# EAGLE board 64CharTestDisp (EAGLE 9.4.2), part 1 of 3
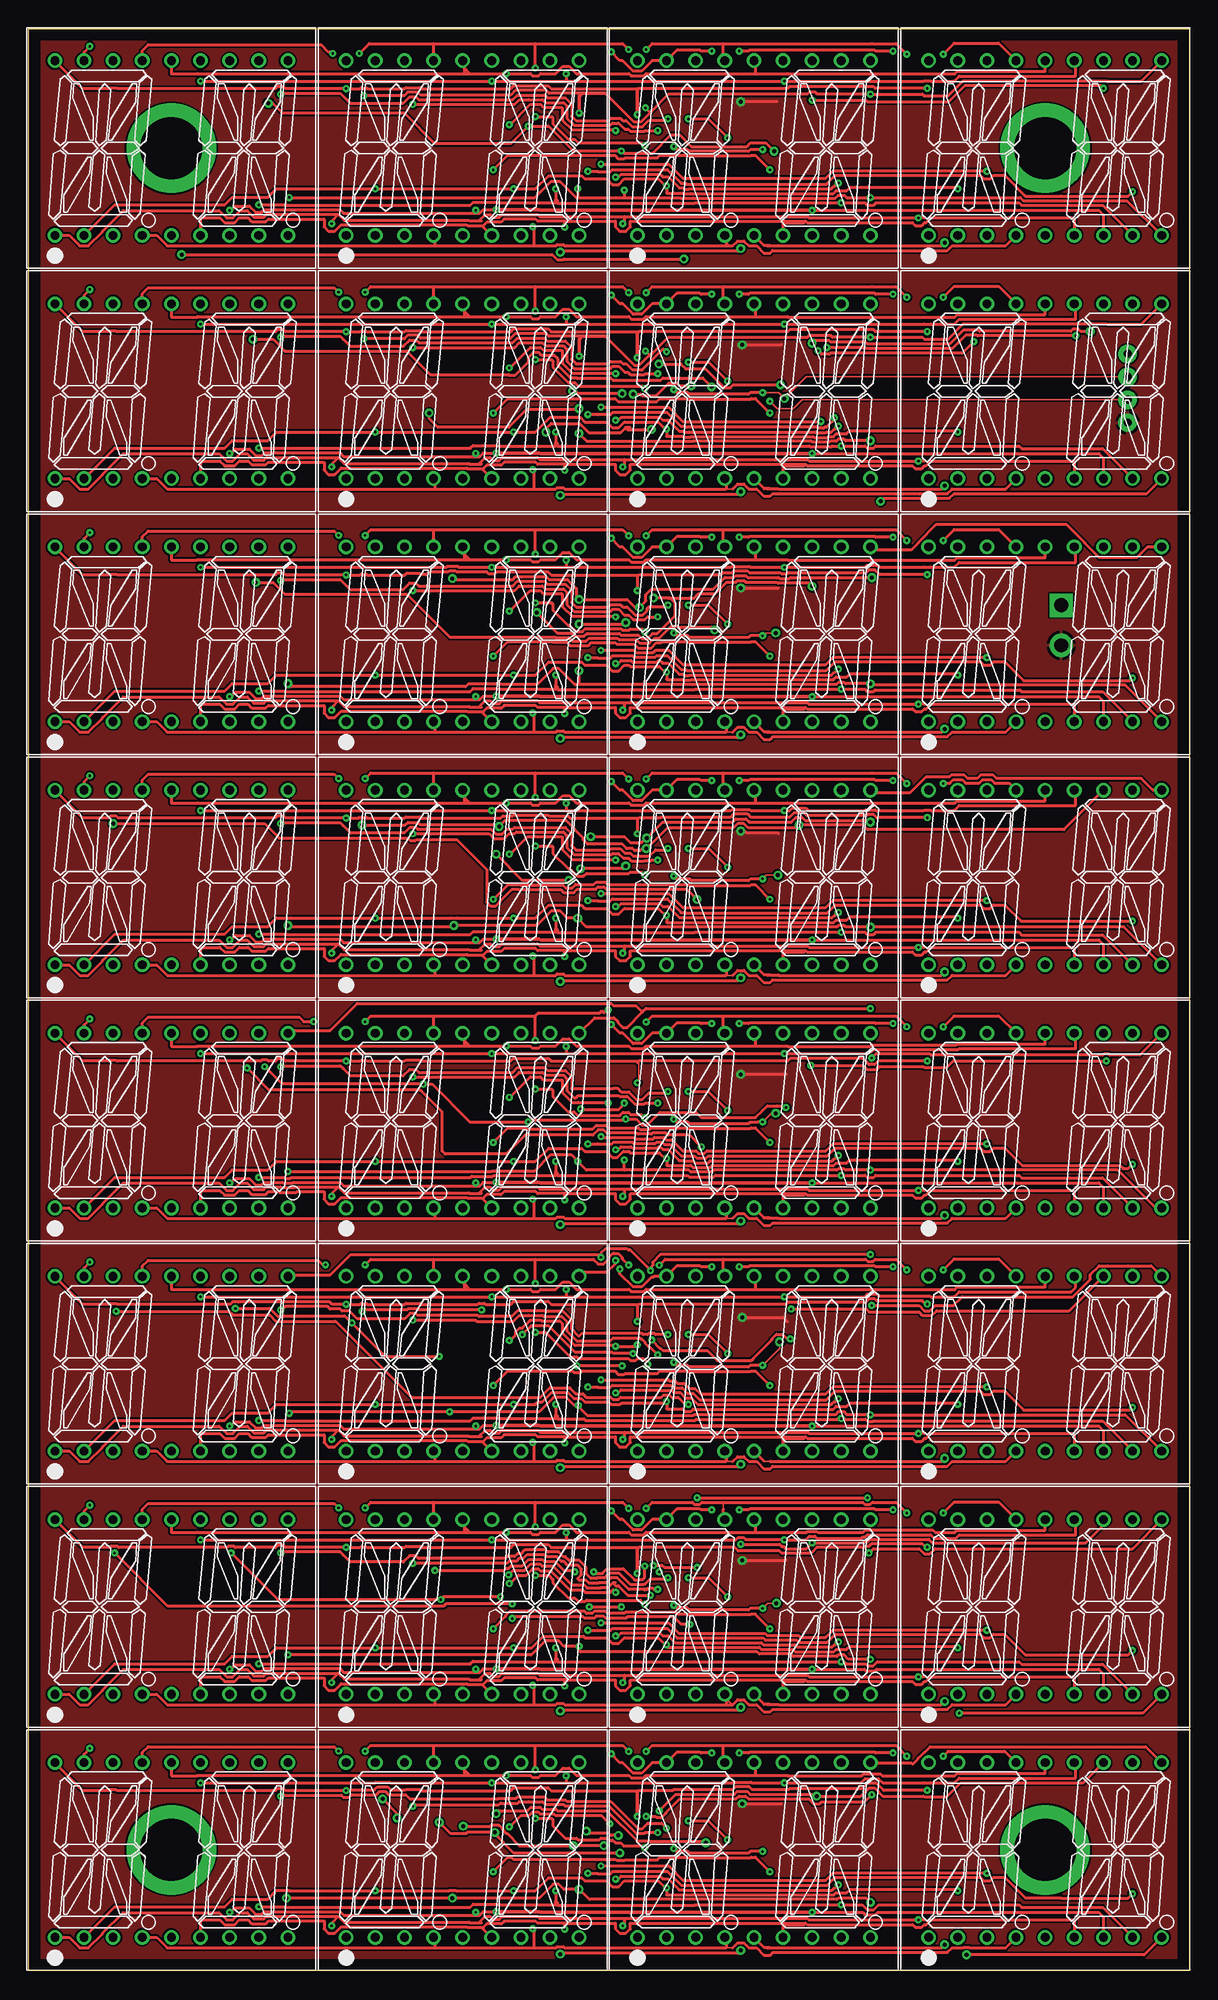
[diagram p9: board, top side]
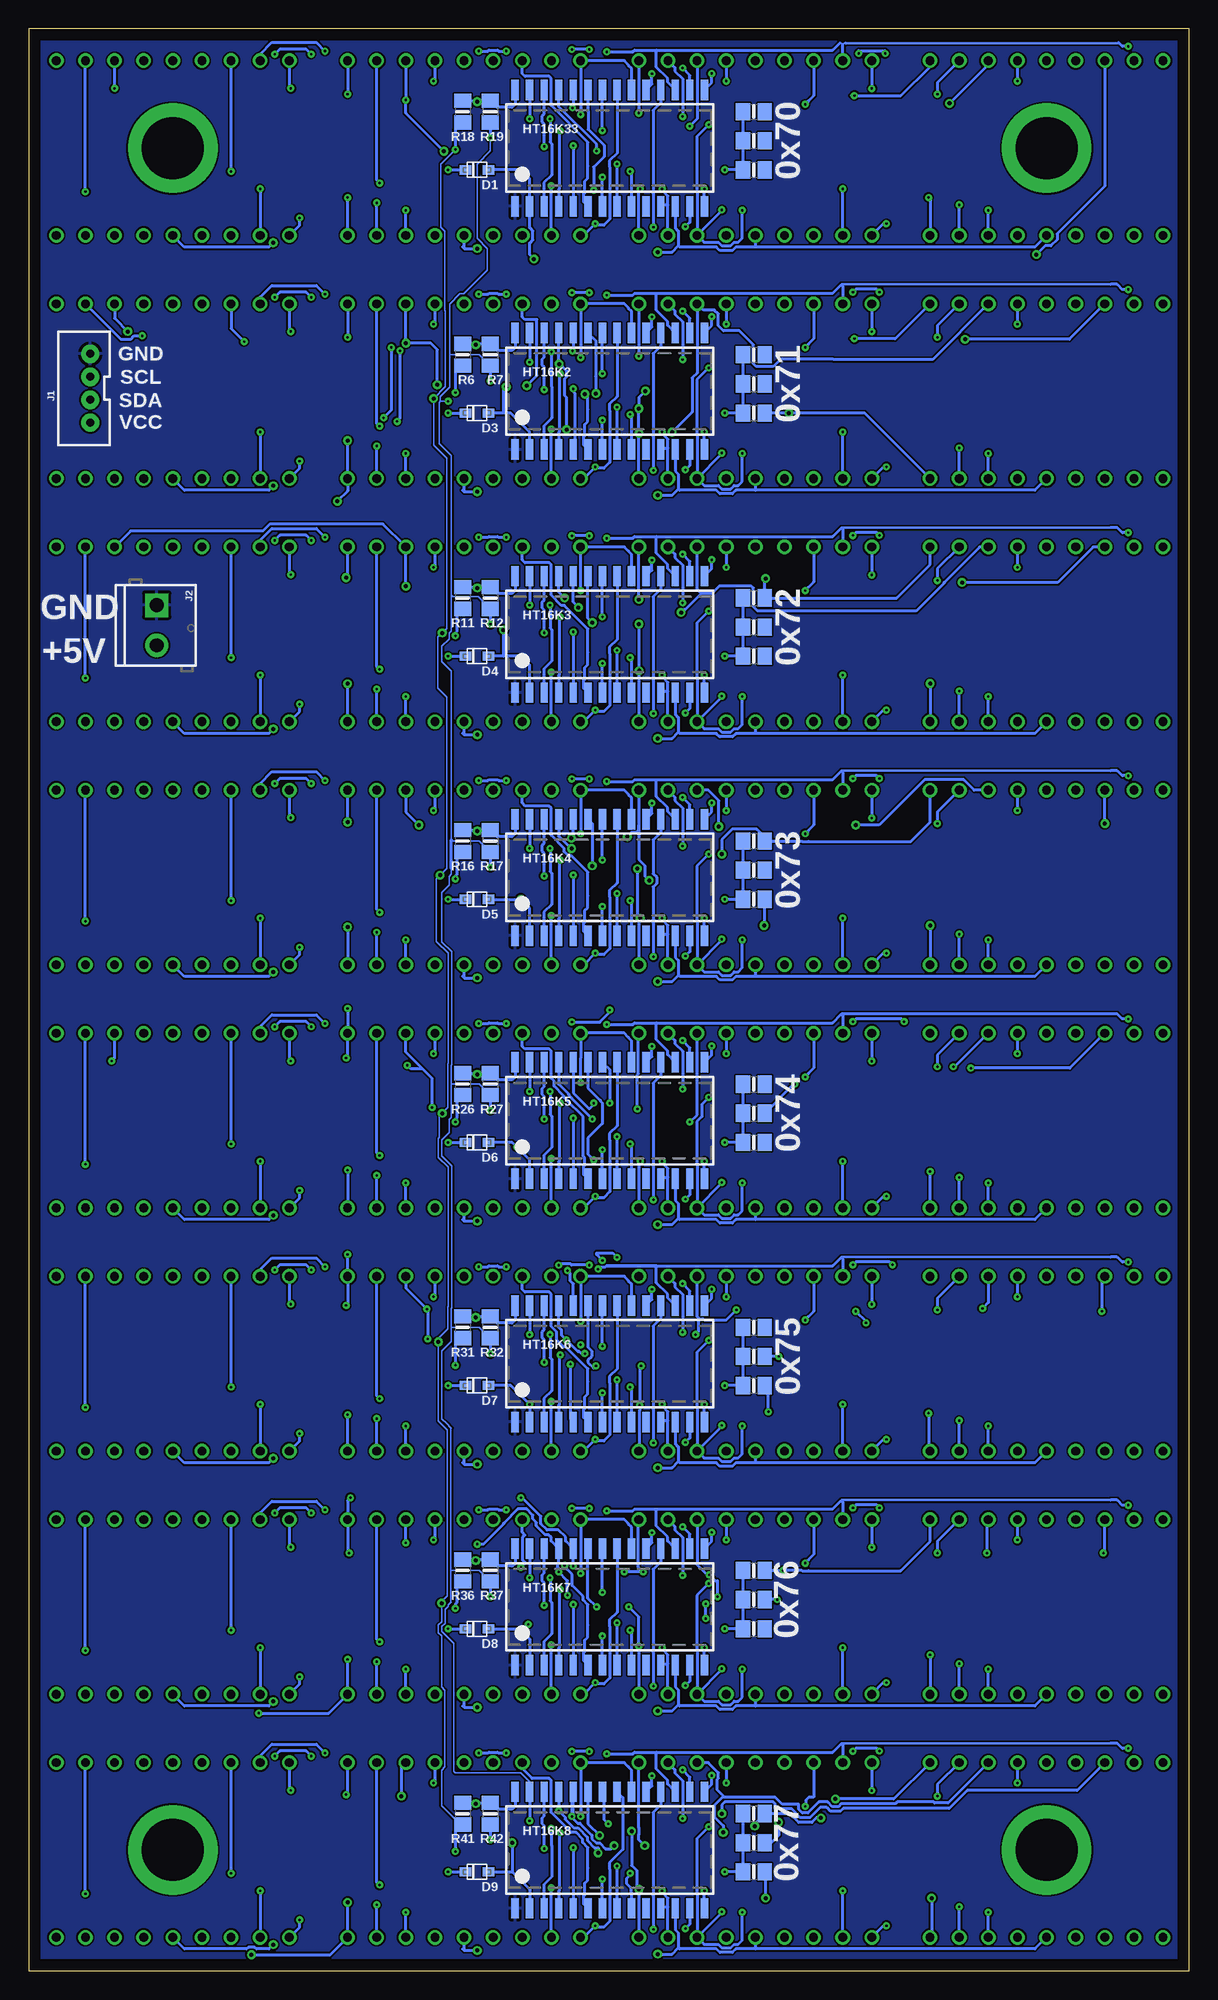
[diagram p10: board, bottom side, seen from below]

Size 101.22 x 169.42 mm. Coordinates in mm from the lower left corner, seen from the top.
Outline: 101.22,0 0,0 0,169.42 101.22,169.42 101.22,0
Copper layers (1*16): Top 0.035mm / dielectric 1.5mm / Bottom 0.035mm
Design rules "default *": minimum track width 6mil, minimum drill 0.2mm, track to track 6mil, track to pad 6mil, pad to pad 6mil, via to via 6mil, smd to smd 6mil, copper to edge 40mil, drill to drill 6mil, minimum pad ring 10mil, minimum via ring 8mil, stop-mask expansion 4mil, vias tented up to drill 0mil, thermal gap 10mil

## Footprints (pad centres in the part's own frame; a part is rotated, then mirrored left to right if it is on the bottom)
SOD-323F = smd 1 x 0.8: A -1,0; C 1,0
SOP28_300MIL_SKINNY = smd 0.635 x 1.778: P$1 -8.255,-5.08; P$2 -6.985,-5.08; P$3 -5.715,-5.08; P$4 -4.445,-5.08; P$5 -3.175,-5.08; P$6 -1.905,-5.08; P$7 -0.635,-5.08; P$8 0.635,-5.08; P$9 1.905,-5.08; P$10 3.175,-5.08; P$11 4.445,-5.08; P$12 5.715,-5.08; P$13 6.985,-5.08; P$14 8.255,-5.08; P$15 8.255,5.08; P$16 6.985,5.08; P$17 5.715,5.08; P$18 4.445,5.08; P$19 3.175,5.08; P$20 1.905,5.08; P$21 0.635,5.08; P$22 -0.635,5.08; P$23 -1.905,5.08; P$24 -3.175,5.08; P$25 -4.445,5.08; P$26 -5.715,5.08; P$27 -6.985,5.08; P$28 -8.255,5.08
JST-4-PTH-VERT = drill 0.7 pad 1.6: 1 -3,-0.55; 2 -1,-0.55; 3 1,-0.55; 4 3,-0.55
SCREWTERMINAL-3.5MM-2 = drill 1.2 pad 2.032 square: 1 0,0 | drill 1.2 pad 2.032: 2 3.5,0
0805-NO = smd 1.24 x 1.5: 1 -0.95,0; 2 0.95,0
HDSP = drill 0.762: 1 -10.16,-7.62; 2 -7.62,-7.62; 3 -5.08,-7.62; 4 -2.54,-7.62; 5 0,-7.62; 6 2.54,-7.62; 7 5.08,-7.62; 8 7.62,-7.62; 9 10.16,-7.62; 10 10.16,7.62; 11 7.62,7.62; 12 5.08,7.62; 13 2.54,7.62; 14 0,7.62; 15 -2.54,7.62; 16 -5.08,7.62; 17 -7.62,7.62; 18 -10.16,7.62
KEYSTONESTANDOFF = drill 5.41 pad 7.8: P$1 0,0

## Placement (x,y rotation side)
D1  1N4148  [SOD-323F]  62.1,157.1 180 bottom
D3  1N4148  [SOD-323F]  62.1,135.89 180 bottom
D4  1N4148  [SOD-323F]  62.1,114.68 180 bottom
D5  1N4148  [SOD-323F]  62.1,93.47 180 bottom
D6  1N4148  [SOD-323F]  62.1,72.26 180 bottom
D7  1N4148  [SOD-323F]  62.1,51.05 180 bottom
D8  1N4148  [SOD-323F]  62.1,29.84 180 bottom
D9  1N4148  [SOD-323F]  62.1,8.64 180 bottom
HT16K2  [SOP28_300MIL_SKINNY]  50.55,137.79 0 bottom
HT16K3  [SOP28_300MIL_SKINNY]  50.55,116.59 0 bottom
HT16K4  [SOP28_300MIL_SKINNY]  50.55,95.38 0 bottom
HT16K5  [SOP28_300MIL_SKINNY]  50.55,74.17 0 bottom
HT16K6  [SOP28_300MIL_SKINNY]  50.55,52.96 0 bottom
HT16K7  [SOP28_300MIL_SKINNY]  50.55,31.75 0 bottom
HT16K8  [SOP28_300MIL_SKINNY]  50.55,10.54 0 bottom
HT16K33  [SOP28_300MIL_SKINNY]  50.55,159 0 bottom
J1  [JST-4-PTH-VERT]  96.39,138.05 90 bottom
J2  [SCREWTERMINAL-3.5MM-2]  90.04,119.13 270 bottom
R6  10K  [0805-NO]  63.37,140.97 270 bottom
R7  10K  [0805-NO]  60.96,140.97 270 bottom
R8  47K  [0805-NO]  37.97,140.97 0 bottom
R9  47K  [0805-NO]  37.97,135.89 0 bottom
R10  47K  [0805-NO]  37.97,138.43 0 bottom
R11  10K  [0805-NO]  63.37,119.76 270 bottom
R12  10K  [0805-NO]  60.96,119.76 270 bottom
R13  47K  [0805-NO]  37.97,119.76 0 bottom
R14  47K  [0805-NO]  37.97,114.68 0 bottom
R15  47K  [0805-NO]  37.97,117.22 0 bottom
R16  10K  [0805-NO]  63.37,98.55 270 bottom
R17  10K  [0805-NO]  60.96,98.55 270 bottom
R18  10K  [0805-NO]  63.37,162.18 270 bottom
R19  10K  [0805-NO]  60.96,162.18 270 bottom
R20  47K  [0805-NO]  37.97,162.18 0 bottom
R21  47K  [0805-NO]  37.97,157.1 0 bottom
R22  47K  [0805-NO]  37.97,159.64 0 bottom
R23  47K  [0805-NO]  37.97,98.55 0 bottom
R24  47K  [0805-NO]  37.97,93.47 0 bottom
R25  47K  [0805-NO]  37.97,96.01 0 bottom
R26  10K  [0805-NO]  63.37,77.34 270 bottom
R27  10K  [0805-NO]  60.96,77.34 270 bottom
R28  47K  [0805-NO]  37.97,77.34 0 bottom
R29  47K  [0805-NO]  37.97,72.26 0 bottom
R30  47K  [0805-NO]  37.97,74.8 0 bottom
R31  10K  [0805-NO]  63.37,56.13 270 bottom
R32  10K  [0805-NO]  60.96,56.13 270 bottom
R33  47K  [0805-NO]  37.97,56.13 0 bottom
R34  47K  [0805-NO]  37.97,51.05 0 bottom
R35  47K  [0805-NO]  37.97,53.59 0 bottom
R36  10K  [0805-NO]  63.37,34.92 270 bottom
R37  10K  [0805-NO]  60.96,34.92 270 bottom
R38  47K  [0805-NO]  37.97,34.92 0 bottom
R39  47K  [0805-NO]  37.97,29.84 0 bottom
R40  47K  [0805-NO]  37.97,32.38 0 bottom
R41  10K  [0805-NO]  63.37,13.72 270 bottom
R42  10K  [0805-NO]  60.96,13.72 270 bottom
R43  47K  [0805-NO]  37.97,13.72 0 bottom
R44  47K  [0805-NO]  37.97,8.64 0 bottom
R45  47K  [0805-NO]  37.97,11.18 0 bottom
U$2  BIG14SEG  [HDSP]  12.45,159 0 top
U$3  BIG14SEG  [HDSP]  37.85,159 0 top
U$4  BIG14SEG  [HDSP]  63.25,159 0 top
U$5  BIG14SEG  [HDSP]  88.65,159 0 top
U$11  BIG14SEG  [HDSP]  12.45,137.79 0 top
U$12  BIG14SEG  [HDSP]  37.85,137.79 0 top
U$13  BIG14SEG  [HDSP]  63.25,137.79 0 top
U$14  BIG14SEG  [HDSP]  88.65,137.79 0 top
U$15  BIG14SEG  [HDSP]  12.45,116.59 0 top
U$16  BIG14SEG  [HDSP]  37.85,116.59 0 top
U$17  BIG14SEG  [HDSP]  63.25,116.59 0 top
U$18  BIG14SEG  [HDSP]  88.65,116.59 0 top
U$19  BIG14SEG  [HDSP]  12.45,95.38 0 top
U$20  BIG14SEG  [HDSP]  37.85,95.38 0 top
U$21  BIG14SEG  [HDSP]  63.25,95.38 0 top
U$22  BIG14SEG  [HDSP]  88.65,95.38 0 top
U$23  BIG14SEG  [HDSP]  12.45,74.17 0 top
U$24  BIG14SEG  [HDSP]  37.85,74.17 0 top
U$25  BIG14SEG  [HDSP]  63.25,74.17 0 top
U$26  BIG14SEG  [HDSP]  88.65,74.17 0 top
U$27  BIG14SEG  [HDSP]  12.45,52.96 0 top
U$28  BIG14SEG  [HDSP]  37.85,52.96 0 top
U$29  BIG14SEG  [HDSP]  63.25,52.96 0 top
U$30  BIG14SEG  [HDSP]  88.65,52.96 0 top
U$31  BIG14SEG  [HDSP]  12.45,31.75 0 top
U$32  BIG14SEG  [HDSP]  37.85,31.75 0 top
U$33  BIG14SEG  [HDSP]  63.25,31.75 0 top
U$34  BIG14SEG  [HDSP]  88.65,31.75 0 top
U$35  KEYSTONESTANDOFF  [KEYSTONESTANDOFF]  12.45,159 0 top
U$36  KEYSTONESTANDOFF  [KEYSTONESTANDOFF]  88.65,159 0 top
U$37  BIG14SEG  [HDSP]  12.45,10.54 0 top
U$38  BIG14SEG  [HDSP]  37.85,10.54 0 top
U$39  BIG14SEG  [HDSP]  63.25,10.54 0 top
U$40  BIG14SEG  [HDSP]  88.65,10.54 0 top
U$41  KEYSTONESTANDOFF  [KEYSTONESTANDOFF]  12.45,10.54 0 top
U$42  KEYSTONESTANDOFF  [KEYSTONESTANDOFF]  88.65,10.54 0 top

## Tracks (layer width: path | path; a pad name or v marks a point on that pad's centre or on a via)
1A0  (via drill 0.2)
  Top 0.254: v22.73,154.69 44.15,154.69 45.57,156.11 46.33,156.11 47.75,154.69 48.01,154.69 | v47.88,155.45 47.88,154.81 48.01,154.69 | 48.01,154.69 51.24,154.69 51.27,154.66 51.94,154.66 | 51.94,154.66 56.85,154.66 56.9,154.61 57.91,154.61 57.93,154.63 70.34,154.63 70.59,154.88 71.14,154.88 71.33,154.69 v73.41,154.69 86.48,154.69 86.76,154.41 95.78,154.41 U$5.9 | 51.82,155.32 v51.94,155.32 51.94,154.66
  Bottom 0.254: U$2.9 22.61,154.56 v22.73,154.69 | U$4.9 v73.41,154.69 | U$3.9 48.01,155.32 v47.88,155.45 | HT16K33.P$23 52.45,162.22 52.43,162.2 52.43,160.63 51.03,159.24 51.03,158.26 51.94,157.35 v51.94,155.32
1A1  (via drill 0.2)
  Top 0.254: U$5.10 97.03,164.85 94.02,164.85 94,164.87 81.49,164.87 80.18,163.55 78.09,163.55 77.94,163.7 v73.41,163.7 68.75,163.7 68.6,163.85 68.05,163.85 67.9,163.7 55.79,163.7 54.19,162.09 | 48.01,163.58 v48.01,162.05 48.01,163.5 48.04,163.54 | v29.21,163.58 32.76,163.58 33.06,163.88 33.94,163.88 34.19,163.63 42.04,163.63 42.45,164.03 45.14,164.03 45.39,163.78 50.3,163.78 | 54.19,162.09 53.36,161.27 52.81,161.27 50.3,163.78 | 48.13,163.63 48.04,163.54 | v53.79,162.5 53.79,162.49 54.19,162.09 | 48.04,163.54 48.29,163.78 50.3,163.78
  Bottom 0.254: U$2.10 22.61,166.12 25.15,163.58 v29.21,163.58 29.46,163.58 | U$4.10 v73.41,163.7 | U$3.10 v48.01,162.05 | HT16K33.P$24 53.72,162.57 v53.79,162.5
1A2  (via drill 0.2, 0.35)
  Top 0.254: v68.33,163.19 72.98,163.19 73.13,163.04 80.24,163.04 81.66,164.47 93.47,164.47 v93.73,164.21 | 62.1,159.13 57.78,159.13 56.77,160.15 56.01,160.15 54.41,158.56 51.88,158.56 v51.69,158.75 51.33,158.75 51.31,158.78 47.47,158.78 45.34,160.91 v43.56,160.91 42.04,159.38 35.42,159.38 32.78,162.03 22.14,162.03 21.27,162.9 v20.91,162.9 | 62.1,159.13 62.61,159.13 | 62.1,159.13 62.61,159.13 | 62.61,159.13 62.94,159.46 64.28,159.46 v65.01,158.74
  Bottom 0.254: U$4.12 v68.33,163.19 68.33,162.05 v65.01,158.74 | v93.73,164.21 U$5.12 | U$3.12 42.93,161.54 v43.56,160.91 | v51.69,158.75 51.69,159.32 54.99,162.62 HT16K33.P$25 | v20.91,162.9 17.53,166.29 U$2.12
2A0  (via drill 0.35)
  Top 0.254: v48.01,136.27 47.9,136.17 43.4,136.17 41.87,134.65 35.69,134.65 34.92,135.41 v34.92,135.89 | v51.74,137.6 47.95,137.6 47.73,137.82 v47.43,137.82 | v74.3,128.2 74.55,128.45 80.3,128.45 80.7,128.85 97.48,128.85 U$14.9 | v73.41,133.48 71.23,133.48 71.11,133.6 70.62,133.6 70.45,133.42 69.91,133.42 69.83,133.35 68.34,133.35 68.27,133.42 57.93,133.42 57.91,133.4 48.7,133.4 v47.98,134.11
  Bottom 0.254: U$11.9 28.32,135.89 v34.92,135.89 R9.2 | U$12.9 48.01,134.11 | 48.01,134.11 48.01,134.24 48.01,136.14 | 48.01,136.14 v48.01,136.27 | HT16K2.P$23 51.78,142.2 51.78,139.09 51.74,139.06 v51.74,137.6 | v47.43,137.82 48.01,137.24 48.01,136.14 | v74.3,128.2 73.41,129.09 U$13.9 v73.41,133.48 | v47.98,134.11 48.01,134.11
2A1  (via drill 0.2)
  Top 0.254: U$14.10 97.03,143.64 94.02,143.64 94,143.66 81.49,143.66 80.18,142.34 78.09,142.34 77.94,142.49 v73.41,142.49 70.11,142.49 69.96,142.64 68.05,142.64 67.9,142.49 55.79,142.49 54.19,140.89 | 48.01,142.37 v48.01,140.84 48.01,142.29 48.04,142.33 | v29.21,142.37 32.76,142.37 33.06,142.67 33.94,142.67 34.19,142.42 42.04,142.42 42.45,142.82 45.14,142.82 45.39,142.57 50.3,142.57 | 48.13,142.42 48.04,142.33 | 50.3,142.57 52.81,140.06 53.21,140.06 53.29,140.13 53.33,140.13 54.08,140.89 54.19,140.89 | v53.79,141.29 53.79,141.28 54.19,140.89 | 48.04,142.33 48.29,142.57 50.3,142.57
  Bottom 0.254: 29.46,142.37 v29.21,142.37 25.65,142.37 U$11.10 | U$13.10 v73.41,142.49 | U$12.10 v48.01,140.84 | HT16K2.P$24 53.72,141.37 v53.79,141.29
2A2  (via drill 0.35)
  Top 0.254: v45.1,134.22 45.1,134.51 45.57,134.98 45.59,134.98 | 45.59,134.98 45.97,134.98 | 45.59,134.98 48.05,134.98 48.84,134.19 51.62,134.19 52.05,134.62 | 52.45,134.62 52.05,134.62 | 52.05,134.62 52.22,134.45 v54.31,134.45 | v54.97,140.16 56.88,140.16 57.29,139.75 59,139.75 60.65,138.1 61.19,138.1 61.44,138.35 v65.58,138.35 | v92.58,143 91.75,143 91.55,143.2 91.07,143.2 90.9,143.03 82.91,143.03 82.83,143.1 81.51,143.1 80.32,141.91 73.17,141.91 72.99,142.09 69.94,142.09 69.84,142.19 68.53,142.19 v68.33,141.99
  Bottom 0.254: U$11.12 22.38,140.56 31.03,140.56 31.05,140.59 35.64,140.59 36.29,139.94 37.76,139.94 38.02,140.21 38.02,141.84 39.24,143.05 40.63,143.05 41.07,143.5 41.07,144.54 41.41,144.88 42.39,144.88 U$12.12 42.93,139.39 43.35,138.96 43.35,135.97 v45.1,134.22 | U$14.12 93.73,144.15 v92.58,143 | U$13.12 v68.33,141.99 66.17,141.99 65.58,141.4 v65.58,138.35 | v54.31,134.45 54.31,137.24 54.48,137.41 54.48,138.88 54.28,139.08 54.28,139.56 54.9,140.18 54.99,140.27 54.99,140.59 | 54.99,140.59 HT16K2.P$25 | 54.99,140.59 54.99,140.19 v54.97,140.16
3A0  (via drill 0.35)
  Top 0.254: 47.88,112.19 57.91,112.19 57.93,112.21 70.45,112.21 70.62,112.39 71.11,112.39 71.23,112.27 v73.41,112.27 73.53,112.14 95.63,112.14 U$18.9 | 47.88,112.19 47.64,112.19 46.21,113.61 45.73,113.61 44.33,112.21 41.26,112.21 41.21,112.26 38.35,112.26 38.1,112.02 22.88,112.02 v22.61,112.29 | v47.98,113.41 47.98,112.3 47.88,112.19 | v48.01,117.47 51.94,117.47 v52.07,117.6
  Bottom 0.254: U$17.9 v73.41,112.27 | v22.61,112.29 U$15.9 | U$16.9 47.98,108.99 v47.98,113.41 47.98,117.45 v48.01,117.47 | v52.07,117.6 52.45,117.98 HT16K3.P$23
3A1  (via drill 0.35)
  Top 0.254: U$18.10 97.56,124.21 96.65,123.29 93.35,123.29 92.1,124.54 92.1,124.58 90.55,126.14 79.12,126.14 77.57,124.58 77.57,124.56 76.96,123.95 73.66,123.95 U$17.10 | v36.96,121.46 37.08,121.33 42.16,121.33 42.45,121.61 45.14,121.61 45.39,121.36 46.98,121.36 47.75,120.59 47.75,119.89 v48.01,119.63 52.2,119.63 53.09,118.75 v53.28,118.94 53.82,119.48 53.82,120.03 54.31,120.52 59.69,120.52 60.71,121.54 61.51,121.54 61.66,121.69 62.54,121.69 62.7,121.54 65.4,121.54 65.5,121.44 66.32,121.44 66.42,121.54 67.18,121.54 | 67.18,121.54 67.67,121.54 | 67.18,121.54 v73.53,121.54
  Bottom 0.254: U$15.10 22.61,122.68 25.53,119.76 R13.2 37.02,121.39 v36.96,121.46 | v48.01,119.63 U$16.10 | v53.28,118.94 53.72,119.38 HT16K3.P$24 | v73.53,121.54 73.41,121.67 U$17.10
3A2  (via drill 0.35)
  Top 0.254: v44.32,118.5 46.11,116.71 47.26,116.71 47.56,116.41 48.45,116.41 48.7,116.66 51.5,116.66 51.63,116.54 53.15,116.54 53.48,116.21 53.96,116.21 54.41,116.66 54.81,116.66 56.34,118.19 56.34,119.37 55.94,119.76 55.75,119.76 | 55.75,119.76 v54.48,119.76 | 55.75,119.76 58.04,119.76 58.39,120.12 59.86,120.12 60.87,121.13 61.68,121.13 61.83,121.28 62.38,121.28 62.53,121.13 65.23,121.13 65.34,121.03 68.07,121.03 v68.33,120.78
  Bottom 0.254: U$17.12 68.39,124.27 | 68.39,124.27 70.33,126.21 80.18,126.21 80.79,125.6 92.33,125.6 U$18.12 | U$15.12 18.29,124.21 21.39,121.11 21.39,121.04 23.81,118.62 37.64,118.62 38.02,119 38.02,120.63 38.19,120.79 41.01,120.79 41.66,120.14 42.54,120.14 | 42.54,120.14 42.93,120.52 U$16.12 | v44.32,118.5 44.07,118.75 43.95,118.75 42.56,120.14 42.54,120.14 | v54.48,119.76 54.99,120.27 HT16K3.P$25 | v68.33,120.78 U$17.12 | U$17.12 68.39,124.27
4A0  (via drill 0.35)
  Top 0.254: U$22.9 95.5,91.06 v73.41,91.06 71.23,91.06 71.11,91.18 70.62,91.18 70.51,91.06 48.64,91.06 v47.88,91.82 46.99,91.82 46.35,92.46 45.59,92.46 44.32,91.19 v37.08,91.19 36.96,91.06 22.73,91.06 v22.61,91.19 | v52.07,96.39 51.82,96.14 v48.13,96.14
  Bottom 0.254: v73.41,91.06 U$21.9 | U$20.9 48.01,91.69 v47.88,91.82 48.13,92.08 v48.13,96.14 | v37.08,91.19 37.02,91.25 R24.2 | v22.61,91.19 U$19.9 | HT16K4.P$23 52.07,100.08 v52.07,96.39
4A1  (via drill 0.35)
  Top 0.254: v47.12,95.12 43.05,95.12 v40.77,97.41 | v49.02,98.93 51.94,98.93 52.45,98.42 53.46,98.42 53.46,98.43 | 53.46,98.43 53.59,98.55 | 53.46,98.43 53.84,98.81 v53.89,98.81 55.28,100.2 61.38,100.2 61.66,100.48 62.54,100.48 62.82,100.2 66.51,100.2 66.91,100.61 67.45,100.61 67.71,100.36 72.92,100.36 73.07,100.2 v73.41,100.2 | U$22.10 98.04,103 97.03,104.01 84.42,104.01 84.11,104.32 83.02,104.32 82.71,104.01 81.88,104.01 81.57,104.32 80.48,104.32 80.3,104.14 78.23,104.14 76.84,102.74 73.66,102.74 U$21.10
  Bottom 0.254: 33.23,98.53 33.2,98.55 | 33.23,98.53 33.77,98.53 33.79,98.55 R23.2 37.02,98.87 37.73,99.58 39.86,99.58 40.77,98.68 v40.77,97.41 | 33.23,98.53 24.28,98.53 22.61,100.2 U$19.10 | U$20.10 48.01,99.95 | 48.01,99.95 48.01,96.94 47.47,96.41 47.47,95.48 v47.12,95.12 | 48.01,99.95 48.04,99.91 48.04,99.45 48.21,99.29 48.67,99.29 v49.02,98.93 | v53.89,98.81 53.72,98.97 HT16K4.P$24 | v73.41,100.2 U$21.10
4A2  (via drill 0.35)
  Top 0.254: v29.08,99.95 32.86,99.95 33.09,100.18 33.91,100.18 34.09,100 40.84,100 v41.02,99.82 41.53,100.33 46.86,100.33 48.36,98.83 48.36,98.66 48.75,98.28 49.29,98.28 49.31,98.3 51.76,98.3 52.16,97.9 52.66,97.9 52.84,97.72 53.33,97.72 53.51,97.9 v53.87,97.9 54.12,98.15 54.16,98.15 55.7,99.69 61.45,99.69 61.83,100.08 62.38,100.08 62.76,99.69 66.93,99.69 v67.18,99.95 72.73,99.95 73.13,99.55 90.27,99.55 U$22.12
  Bottom 0.254: U$19.12 18.77,103 19.69,103.91 23.09,103.91 27.05,99.95 v29.08,99.95 | v41.02,99.82 41.02,102.07 41.95,103 U$20.12 | v53.87,97.9 54.12,98.15 54.16,98.15 54.99,98.98 HT16K4.P$25 | U$21.12 68.33,101.09 v67.18,99.95
5A0  (via drill 0.2)
  Top 0.254: U$26.9 98.3,66.55 95,69.85 v73.41,69.85 71.23,69.85 71.11,69.97 70.62,69.97 70.51,69.85 59.77,69.85 59.59,69.67 57.76,69.67 57.58,69.85 51.94,69.85 | v22.61,69.72 40.31,69.72 40.36,69.77 44.11,69.77 45.54,71.19 47.3,71.19 v47.88,70.61 48.64,69.85 51.94,69.85 | 51.94,69.85 v51.94,70.74
  Bottom 0.254: v73.41,69.85 U$25.9 | v47.88,70.61 48.01,70.48 U$24.9 | U$23.9 v22.61,69.72 | v51.94,70.74 52.45,71.25 52.45,72.64 51.18,73.91 51.18,75.69 51.36,75.87 51.36,75.93 52.45,77.03 HT16K5.P$23
5A1  (via drill 0.2)
  Top 0.254: v51.94,75.69 51.76,75.52 51.76,75.45 51.42,75.11 48.21,75.11 v48.13,75.18 | U$23.10 22.86,82.04 26.29,82.04 28.65,84.4 50.79,84.4 50.99,84.2 52.96,84.2 53.53,83.63 | U$24.10 49.35,83.13 51.04,83.13 51.38,82.79 51.38,82.73 51.82,82.3 52.2,82.3 53.53,83.63 | 53.53,83.63 53.85,83.95 v73.41,83.95 | U$26.10 96.9,79.88 94.3,79.88 94.22,79.96 93.74,79.96 93.66,79.88 78.68,79.88 78.6,79.96 73.86,79.96 v73.53,79.63
  Bottom 0.254: HT16K5.P$24 53.72,76.58 52.32,75.18 51.94,75.57 v51.94,75.69 | v48.13,75.18 48.13,78.15 48.04,78.24 48.04,81.75 U$24.10 | v73.41,83.95 U$25.10 73.41,79.76 v73.53,79.63
5A2  (via drill 0.2)
  Top 0.254: v20.57,78.87 22.1,77.34 v34.42,77.34 35.18,77.34 38.48,74.04 v43.56,74.04 43.69,74.17 51.94,74.17 v52.07,74.3 52.98,74.3 53.48,73.79 53.96,73.79 55.05,74.88 56.26,74.88 58.22,74.88 58.67,74.42 63.37,74.42 64.01,75.06 64.41,75.46 65.28,75.46 65.89,75.46 v66.04,75.31 | v68.2,78.99 72.77,78.99 73.12,78.64 73.94,78.64 74.17,78.87 78.04,78.87 78.12,78.79 80.06,78.79 80.65,79.38 v93.98,79.38
  Bottom 0.254: R30.2 34.48,77.34 v34.42,77.34 | v20.57,78.87 20.45,78.87 U$23.12 | v52.07,74.3 53.88,76.1 53.88,76.16 54.13,76.41 54.13,76.48 54.99,77.34 HT16K5.P$25 | v43.56,74.04 42.93,74.68 U$24.12 | v66.04,75.31 66.04,77.85 66.87,78.68 | U$25.12 68.33,80.14 66.87,78.68 | 66.87,78.68 67.88,78.68 v68.2,78.99 | v93.98,79.38 93.73,79.63 U$26.12
6A0  (via drill 0.2)
  Top 0.254: U$30.9 95.63,48.51 v73.41,48.51 71.35,48.51 71.11,48.76 70.62,48.76 70.38,48.51 58.04,48.51 57.94,48.41 48.74,48.41 47.88,49.28 v47.94,49.34 47.56,49.34 46.86,50.04 45.78,50.04 44.52,48.77 v36.7,48.77 22.86,48.77 v22.73,48.64 | v51.75,52.77 47.94,52.77 47.88,52.83 v47.82,52.77
  Bottom 0.254: U$29.9 v73.41,48.51 | v47.94,49.34 47.94,49.28 | 47.94,49.28 47.94,48.91 47.97,48.88 47.97,45.38 U$28.9 | v22.73,48.64 22.73,45.47 U$27.9 | v36.7,48.77 36.7,50.73 R34.2 | v51.75,52.77 51.94,52.58 52.45,53.09 52.45,53.28 52.12,53.61 52.12,54.09 52.45,54.42 HT16K6.P$23 | v47.82,52.77 47.94,52.64 47.94,49.28
6A1  (via drill 0.2)
  Top 0.254: U$27.10 22.73,60.71 26.29,60.71 28.07,62.48 49.66,62.48 v49.91,62.23 49.91,62.61 50.29,62.99 52.2,62.99 52.32,62.87 52.45,62.87 54.1,61.21 | U$28.10 48.39,60.96 50.42,60.96 51.18,61.72 v51.18,61.98 | v54.23,61.09 54.1,61.21 | 54.1,61.21 54.41,61.52 54.41,61.8 55.1,62.48 v73.41,62.48 | v73.53,58.04 77.66,58.04 78.12,57.58 78.6,57.58 79.06,58.04 80.65,58.04 81.41,58.8 91.06,58.8 92.58,60.33 92.58,60.73 93.35,61.49 94.11,61.49 94.13,61.47 95.86,61.47 95.89,61.49 97.89,61.49 U$30.10
  Bottom 0.254: v51.18,61.98 51.69,62.48 51.69,62.61 50.29,62.61 v49.91,62.23 | HT16K6.P$24 53.72,59.92 54,60.2 54,60.86 v54.23,61.09 | v73.41,62.48 U$29.10 73.41,58.17 v73.53,58.04
6A2  (via drill 0.2)
  Top 0.254: v18.03,57.78 21.02,57.78 21.73,57.08 22.21,57.08 22.29,57.15 27.56,57.15 v28.19,56.52 31.12,53.59 v35.81,53.59 | v39.5,57.66 34.01,57.66 33.91,57.76 33.09,57.76 32.99,57.66 29.21,57.66 v29.08,57.53 | v43.05,55.5 43.81,56.26 43.93,56.26 43.95,56.29 45.31,56.29 47.62,53.98 49.4,53.98 | 49.4,53.98 49.66,53.98 | 49.4,53.98 50.86,53.98 50.94,53.9 52.65,53.9 v52.7,53.85 | v54.32,55.02 55.04,54.3 55.1,54.3 55.31,54.1 55.88,54.1 59.18,54.1 59.94,53.34 60.02,53.27 63.04,53.27 63.25,53.47 64.82,55.04 64.82,55.14 65.21,55.52 65.75,55.52 66.16,55.12 v66.42,55.12 | U$30.12 90.73,57.58 79.18,57.58 78.77,57.18 77.95,57.18 77.67,57.46 73.29,57.46 73.03,57.72 v66.48,57.72
  Bottom 0.254: U$27.12 17.53,58.29 v18.03,57.78 | v35.81,53.59 R35.2 | U$28.12 42.93,57.07 42.84,56.98 | 42.84,56.98 42.72,56.87 42.39,56.87 42.29,56.77 40.39,56.77 v39.5,57.66 | v29.08,57.53 28.19,56.64 v28.19,56.52 | 42.84,56.98 42.84,55.71 v43.05,55.5 | v52.7,53.85 53,53.85 53.18,54.03 53.33,54.03 v54.32,55.02 54.76,55.46 54.76,55.91 54.99,56.14 HT16K6.P$25 | v66.42,55.12 66.42,57.66 v66.48,57.72 68.33,59.56 U$29.12
7A0  (via drill 0.2)
  Top 0.254: v73.41,27.18 71.48,27.18 71.11,27.55 70.62,27.55 70.5,27.42 66.69,27.42 66.47,27.64 63.73,27.64 63.55,27.81 48.13,27.81 48.01,27.94 v48.01,28.32 46.67,28.32 46.21,28.78 45.03,28.78 43.81,27.56 v22.61,27.56 | v48.89,31.75 v51.69,31.75 | U$34.9 97.16,22.48 v81.15,22.48
  Bottom 0.254: v73.41,27.18 U$33.9 75.06,22.48 v81.15,22.48 | U$32.9 v48.01,28.32 48.01,30.86 v48.89,31.75 | v22.61,27.56 U$31.9 | v51.69,31.75 52.45,32.51 HT16K7.P$23
7A1  (via drill 0.2)
  Top 0.254: v47.62,34.8 47.5,34.92 46.68,34.92 45.89,35.71 44.95,35.71 44.77,35.89 43.62,35.89 43.06,35.33 42.07,35.33 41.86,35.12 41.62,35.12 41.42,34.92 v35.43,34.92 | v49.28,34.8 49.4,34.67 50.03,34.67 50.43,35.08 51.86,35.08 52.84,34.09 53.33,34.09 53.37,34.13 53.56,34.13 53.72,34.29 53.72,35.18 v53.72,35.31 | v58.29,41.27 v73.15,41.27 | v73.28,36.45 73.66,36.83 77.66,36.83 78.12,36.37 78.6,36.37 79.06,36.83 96.27,36.83 U$34.10
  Bottom 0.254: 33.2,34.92 33.23,34.9 | 33.23,34.9 33.77,34.9 33.79,34.92 v35.43,34.92 R38.2 | 33.23,34.9 25.17,34.9 22.61,37.46 U$31.10 | U$32.10 48.04,39.33 48.04,35.22 v47.62,34.8 v49.28,34.8 | v53.72,35.31 HT16K7.P$24 54.39,37.5 54.39,37.84 55.02,38.46 56,38.46 56.54,38.99 56.54,39.65 58.17,41.27 v58.29,41.27 | v73.15,41.27 73.41,41.02 U$33.10 73.41,36.58 v73.28,36.45
7A2  (via drill 0.2)
  Top 0.254: v17.65,36.45 21.72,32.38 v35.94,32.38 36.2,32.64 v41.15,32.64 | v41.86,34.54 42.24,34.92 43.23,34.92 43.79,35.48 44.61,35.48 44.78,35.31 45.72,35.31 47.37,33.66 48.45,33.66 48.7,33.4 49.85,33.4 49.9,33.45 50.55,33.45 50.6,33.5 50.6,33.52 50.94,33.86 | 51.18,33.86 50.94,33.86 | 50.94,33.86 51.19,33.6 51.42,33.6 52.26,32.77 v54.23,32.77 | v62.1,37.21 65.47,37.21 65.67,37.01 65.86,37.01 66.04,36.83 67.82,36.83 v68.33,37.34 72.77,37.34 72.87,37.44 73.12,37.44 73.32,37.64 78.5,37.64 78.8,37.34 92.2,37.34 93.73,38.86 U$34.12
  Bottom 0.254: U$31.12 17.65,39.24 v17.65,36.45 | v35.94,32.38 R40.2 | U$32.12 42.93,35.43 41.86,34.37 41.78,34.37 | 41.78,34.37 41.67,34.37 41.34,34.04 41.15,34.04 v41.15,32.64 | 41.78,34.37 41.86,34.44 v41.86,34.54 | v54.23,32.77 54.23,34.04 v54.99,34.8 54.99,35.05 55.06,35.12 55.06,35.6 54.99,35.67 HT16K7.P$25 55.66,37.5 55.66,37.84 55.88,38.05 56.17,38.05 56.95,38.82 56.95,39.12 57.25,39.42 57.25,39.75 57.79,40.28 58.54,40.28 59.79,39.04 59.79,38.99 61.57,37.21 v62.1,37.21 | v68.33,37.34 U$33.12
8A0  (via drill 0.35)
  Top 0.254: U$40.9 97.28,1.4 v81.79,1.4 | v73.41,5.97 73.03,6.34 70.62,6.34 70.51,6.22 48.89,6.22 v48.01,7.11 46.67,7.11 46.21,7.57 45.73,7.57 44.52,6.35 v36.96,6.35 v22.48,6.35 | v51.43,11.81 50.78,11.81 50.61,11.99 48.85,11.99 v48.64,12.19
  Bottom 0.254: v81.79,1.4 74.93,1.4 U$39.9 v73.41,5.97 | U$38.9 v48.01,7.11 48.18,7.29 48.18,8.51 48.18,8.75 48.64,9.21 v48.64,12.19 | HT16K8.P$23 52.45,12.83 v51.43,11.81 | v36.96,6.35 36.96,8.57 R44.2 | v22.48,6.35 22.48,3.05 U$37.9
8A1  (via drill 0.2, 0.35)
  Top 0.254: v30.86,14.99 32.13,13.72 v32.13,13.33 | v37.9,12.62 40.27,12.62 40.37,12.72 40.91,12.72 40.93,12.7 41.02,12.7 41.33,12.39 41.33,12.33 41.67,11.99 41.73,11.99 42.8,10.92 v47.5,10.92 v50.16,10.92 | U$39.10 76.32,18.16 76.34,18.15 76.98,18.15 77.09,18.03 77.57,18.52 77.57,18.54 78.11,19.07 78.13,19.07 78.61,19.56 97.41,19.56 U$40.10 | v53.84,13.46 54.67,13.46 54.75,13.39 55.23,13.39 55.57,13.73 55.57,13.79 56.77,14.99 61.7,14.99 61.96,15.24 62.5,15.24 62.76,14.99 68.03,14.99 68.44,14.58 68.98,14.58 69.13,14.73 72.9,14.73 v73.53,15.37
  Bottom 0.254: U$37.10 25.78,14.99 v30.86,14.99 | v32.13,13.33 32.54,13.33 32.92,12.96 34.08,12.96 34.84,13.72 R43.2 37.9,12.84 v37.9,12.62 | v47.5,10.92 48.01,11.43 48.01,11.9 47.98,11.92 47.98,12.46 48.01,12.49 U$38.10 | v50.16,10.92 50.42,10.67 50.93,10.67 51.41,11.15 51.71,11.15 52.09,11.54 52.09,11.83 53.14,12.88 53.33,12.88 53.72,13.27 HT16K8.P$24 53.84,15.5 v53.84,13.46 | v73.53,15.37 73.41,15.49 U$39.10
8A2  (via drill 0.2, 0.35)
  Top 0.254: v35.81,12.95 36.8,11.96 38.17,11.96 38.27,12.06 v40.64,12.06 40.64,11.94 42.31,10.26 51.54,10.26 v51.56,10.29 | U$40.12 91.95,16.38 81.28,16.38 80.06,15.16 78.12,15.16 78.04,15.24 74.48,15.24 73.77,15.95 73.29,15.95 72.58,15.24 v68.71,15.24 68.56,15.39 62.92,15.39 62.67,15.65 61.79,15.65 61.53,15.39 56.41,15.39 v54.99,13.97
  Bottom 0.254: U$37.12 21.03,14.66 22.21,14.66 22.29,14.73 25.46,14.73 25.61,14.58 30.34,14.58 30.59,14.33 31.13,14.33 31.54,14.73 32.29,14.73 33.26,13.77 33.74,13.77 34.08,14.11 34.08,14.53 35.5,14.53 36.12,15.15 40.51,15.15 | v40.64,12.06 40.64,12.66 41.42,13.44 41.42,14.46 40.73,15.15 40.51,15.15 | v35.81,12.95 35.81,11.81 36.45,11.18 R45.2 | 40.51,15.15 41.15,15.79 41.15,16.73 41.07,16.8 41.07,17.28 41.95,18.16 U$38.12 | v51.56,10.29 51.56,10.73 51.58,10.75 51.88,10.75 52.5,11.37 52.5,11.66 53.31,12.47 53.68,12.47 54.43,13.22 54.43,13.4 v54.99,13.97 HT16K8.P$25 | U$39.12 68.71,17.78 v68.71,15.24
GND
  pour Bottom: 0,169.42 101.22,169.42 101.22,0.13 0,0.13
N$1  (via drill 0.35)
  Top 0.254: v13.33,149.71 45.64,149.71 46.08,149.27 46.63,149.27 46.69,149.33 v57.15,149.33
  Bottom 0.254: D1.A 58.29,157.1 57.53,156.34 HT16K33.P$2 57.53,152.04 57.25,151.76 57.25,151 57.53,150.73 57.53,149.71 v57.15,149.33 | U$2.16 7.37,155.68 11.53,151.51 11.53,151 12.07,150.47 12.58,150.47 v13.33,149.71
N$2  (via drill 0.35)
  Top 0.254: v19.56,142.32 21.32,142.32 22.34,141.3 32.98,141.3 35.04,139.24 41.86,139.24 41.91,139.19 42.42,139.19 43.61,140.39 43.61,140.78 44.03,141.2 44.47,141.2 44.72,140.95 45.8,140.95 46.13,140.62 46.13,140.07 47.23,138.97 47.78,138.97 47.81,138.94 50.74,138.94 50.94,138.74 55.1,138.74 55.31,138.94 58.8,138.94 v59.56,138.17
  Bottom 0.254: HT16K2.P$2 57.53,134.24 59.18,135.89 59.82,135.89 | 59.82,135.89 D3.A | U$11.16 10.46,142.32 v19.56,142.32 | v59.56,138.17 59.82,137.92 59.82,135.89
N$3  (via drill 0.2)
  Top 0.254: U$5.7 93.73,153.16 93.32,153.57 53.21,153.57 44.6,153.57 | 68.33,153.31 v68.33,153.57 44.6,153.57 | v38.99,153.57 38.99,153.31 | v41.91,161.04 41.91,160.97 43.75,162.81 44.64,162.81 44.89,162.56 46.48,162.56 46.54,162.51 46.54,161.44 47.4,160.58 51.13,160.58 v51.18,160.53 | v17.53,153.57 17.63,153.57 18.02,153.95 19.24,153.95 19.79,153.39 20.34,153.39 20.57,153.62 27.17,153.62 27.47,153.31 39.33,153.31 39.63,153.62 v40.77,153.62 | 44.55,153.62 44.6,153.57 | v40.77,153.62 44.55,153.62 | 44.6,153.57 44.55,153.62 | 44.55,153.62 v40.77,153.62
  Bottom 0.254: U$2.7 v17.53,153.57 | U$4.7 v68.33,153.57 | v38.99,153.57 38.99,151.13 39.34,150.77 39.7,150.77 40.01,150.47 40.77,150.47 41.07,150.77 42.32,150.77 U$3.7 | U$3.7 42.93,155.15 42.95,155.18 42.95,160 v41.91,161.04 | v51.18,160.53 HT16K33.P$22 | U$3.7 40.77,153.54 v40.77,153.62
N$4  (via drill 0.2)
  Top 0.254: U$2.1 3.53,151.38 4.45,150.47 5.21,150.47 6.45,151.72 6.45,151.76 8.23,153.54 16.62,153.54 17.25,152.91 17.8,152.91 18.43,153.54 19.07,153.54 19.62,152.99 20.51,152.99 20.73,153.22 27,153.22 | 39.24,152.65 38.44,152.65 38.39,152.71 27.51,152.71 27,153.22 | 39.24,152.65 39.5,152.65 | 51.94,153.03 67.93,153.03 68.05,152.91 v77.6,152.91 78.11,152.91 | 51.94,153.03 51.94,152.53 v51.82,152.4 | 27,153.22 26.42,152.63 v26.42,152.4 | 51.94,153.03 44.56,153.03 44.38,153.21 41.29,153.21 41.04,152.96 40.49,152.96 40.24,153.21 39.8,153.21 39.24,152.65
  Bottom 0.254: U$5.1 77.6,152.27 v77.6,152.91 | U$4.1 52.83,151.38 v51.82,152.4 51.69,152.27 51.05,152.27 50.52,152.8 50.52,157.29 50.57,157.34 50.57,157.88 49.91,158.54 HT16K33.P$21 | v26.42,152.4 26.67,152.4 U$3.1
N$5  (via drill 0.2)
  Top 0.254: U$2.18 4.72,164.19 7.05,164.19 7.09,164.23 7.64,164.23 7.68,164.19 21.53,164.19 21.7,164.36 22.24,164.36 22.42,164.19 v27.69,164.19 28.89,164.19 28.94,164.23 29.48,164.23 29.53,164.19 32.79,164.19 32.89,164.28 34.11,164.28 34.2,164.19 42.03,164.19 42.28,164.44 45.31,164.44 45.56,164.19 53.21,164.19 | 53.09,164.19 v53.09,161.93 53.09,164.06 53.21,164.19 | v78.36,164.21 73.83,164.21 73.68,164.36 66.36,164.36 66.19,164.19 53.21,164.19
  Bottom 0.254: U$5.18 78.49,164.34 v78.36,164.21 | U$3.18 v27.69,164.19 | v53.09,161.93 U$4.18 49.28,166.62 48.92,166.27 48.92,166.25 48.64,165.97 HT16K33.P$20
N$6  (via drill 0.2)
  Top 0.254: v14.99,164.85 v40.39,164.85 46.86,164.85 | 46.86,164.85 v65.91,164.85 78.06,164.85 78.09,164.87 78.63,164.87 78.65,164.85 80.7,164.85 81.14,165.28 91.31,165.28 91.31,166.5 U$5.13 | v46.86,165.48 46.86,164.85
  Bottom 0.254: U$2.13 v14.99,164.85 | U$4.13 65.79,164.97 v65.91,164.85 | U$3.13 v40.39,164.85 | HT16K33.P$19 46.86,164.59 v46.86,165.48
N$7  (via drill 0.2)
  Top 0.254: U$2.6 14.99,152.91 16.68,152.91 17.09,152.5 17.97,152.5 18.37,152.91 19.13,152.91 19.46,152.58 20.68,152.58 20.9,152.81 25.76,152.81 25.76,152.13 26.14,151.74 26.69,151.74 27.24,152.3 38.22,152.3 38.28,152.25 39.66,152.25 | U$5.6 91.19,152.78 91.06,152.91 78.68,152.91 78.27,152.5 78.12,152.5 77.87,152.25 77.33,152.25 77.07,152.5 67.89,152.5 67.76,152.63 | U$3.6 39.66,152.1 39.66,152.25 | U$4.6 65.79,152.5 | 65.91,152.63 65.79,152.5 | v46.74,152.09 46.74,152.5 46.86,152.63 | 46.86,152.63 51.16,152.63 51.16,152.13 51.54,151.74 52.09,151.74 52.47,152.13 52.47,152.63 67.76,152.63 | 39.66,152.25 39.97,152.55 41.21,152.55 41.46,152.8 44.21,152.8 44.39,152.63 46.86,152.63 | 65.79,152.5 67.63,152.5 67.76,152.63
  Bottom 0.254: HT16K33.P$18 46.1,162.94 46.76,162.28 46.76,155.05 46.74,155.03 v46.74,152.09
N$8  (via drill 0.2)
  Top 0.254: v40.51,157.1 41.78,158.37 51.14,158.37 51.42,158.09 51.96,158.09 52.02,158.15 54.84,158.15 55.06,158.37 57.4,158.37 57.45,158.32 62.95,158.32 63,158.37 63.37,158.37 v64.64,157.1
  Bottom 0.254: R20.1 R22.1 R21.1 v40.51,157.1 | v64.64,157.1 D1.C
N$9  (via drill 0.35)
  Top 0.254: v19.81,121.11 21.32,121.11 22.34,120.09 32.98,120.09 36.71,116.36 45.89,116.36 45.94,116.31 47.09,116.31 47.4,116 48.61,116 48.87,116.26 51.34,116.26 51.46,116.13 52.99,116.13 53.31,115.81 54.13,115.81 54.58,116.26 54.98,116.26 56.02,117.3 56.5,117.3 56.58,117.22 59.56,117.22 v59.82,116.96
  Bottom 0.254: HT16K3.P$2 57.53,113.92 58.29,114.68 59.82,114.68 | 59.82,114.68 D4.A | U$15.16 8.38,124.21 11.47,121.11 v19.81,121.11 | v59.82,116.96 59.82,114.68
N$10  (via drill 0.2)
  Top 0.254: U$2.17 4.83,167.36 v5.33,167.87 | v75.38,167.47 73.86,167.47 73.79,167.54 62.87,167.54 62.79,167.47 v61.98,167.47 | v59.56,167.47 58.62,167.47 58.54,167.54 56.54,167.54 U$4.17 54.38,166.62 53.46,165.71 52.71,165.71 51.79,166.62 51.56,166.62 v50.8,167.39
  Bottom 0.152: 30.48,168.16 30.35,168.16 30.23,168.03 30.1,168.16 29.97,168.16
  Bottom 0.254: v5.33,167.87 5.84,167.87 6.16,168.19 29.97,168.16 | U$5.17 81.03,167.21 80.01,168.22 76.14,168.22 v75.38,167.47 | U$3.17 30.23,168.03 | v61.98,167.47 61.16,167.47 61.09,167.54 60.33,167.54 60.25,167.47 v59.56,167.47 | v50.8,167.39 48.54,167.39 48.38,167.54 46.48,167.54 | 30.48,168.16 31.1,167.54 46.48,167.54 | HT16K33.P$17 45.5,164.76 45.5,165.09 46.48,166.07 46.48,167.54
N$11  (via drill 0.2)
  Top 0.254: U$2.15 9.91,167.51 10.41,168.02 25.5,168.02 26.14,167.38 26.39,167.38 v26.52,167.25 | v28.83,167.25 29.7,168.12 35.31,168.12 | v52.32,167.6 51.8,168.12 44.2,168.12 | v53.85,167.6 54.37,168.12 60.58,168.12 | v76.58,167.19 75.65,168.12 73.53,168.12 60.58,168.12 | v79.76,167.19 80.72,168.15 84.58,168.15 U$5.15 | 35.31,168.12 44.2,168.12 | U$4.15 60.58,166.75 60.58,168.12 | U$3.15 35.31,168.12 | v44.2,165.99 44.2,168.12
  Bottom 0.254: v52.32,167.6 v53.84,167.6 v53.85,167.6 | v28.83,167.25 28.83,167.5 26.52,167.5 v26.52,167.25 | v76.58,167.19 77.03,167.64 79.3,167.64 v79.76,167.19 | HT16K33.P$16 43.56,165.35 v44.2,165.99
N$12  (via drill 0.2)
  Top 0.254: U$2.14 12.45,165.48 14.69,165.48 14.71,165.5 v41.66,165.5 | U$4.14 63.37,166.5 63.37,165.5 | 63.37,165.5 63.37,165.48 | U$3.14 37.97,166.5 37.97,165.99 | 37.97,165.99 37.97,165.48 | 63.37,165.5 53.83,165.5 53.63,165.3 52.54,165.3 52.34,165.5 47.77,165.5 47.13,166.14 46.59,166.14 45.96,165.5 44.64,165.5 44.47,165.33 43.92,165.33 43.75,165.5 v41.66,165.5 | U$5.14 88.65,165.68 80.97,165.68 80.77,165.48 66.21,165.48 66.19,165.5 63.37,165.5 | 37.97,165.99 38.46,165.5 v41.66,165.5
  Bottom 0.254: HT16K33.P$15 41.66,164.72 v41.66,165.5
N$16  (via drill 0.2)
  Top 0.254: v54.86,160.53 53.77,160.53 53.7,160.46 52.48,160.46 52.28,160.66 51.98,160.66 51.45,161.19 50.91,161.19 50.71,160.99 47.56,160.99 46.94,161.61 46.94,162.68 46.65,162.97 45.06,162.97 44.8,163.22 43.59,163.22 43.58,163.22 42.78,163.22 42.38,162.81 v33.5,162.81
  Bottom 0.254: v33.5,162.81 33.25,163.06 33.25,163.09 32.77,163.58 U$3.16 | HT16K33.P$4 54.99,155.41 54.97,155.43 54.97,160.42 v54.86,160.53
N$17  (via drill 0.2)
  Top 0.254: v49.91,157.61 55.8,157.61 57.05,156.36 69.51,156.36 70.17,157.02 83.52,157.02 v83.57,156.97
  Bottom 0.254: v83.57,156.97 U$5.16 | HT16K33.P$8 v49.91,157.61
N$18  (via drill 0.2)
  Top 0.254: v44.2,161.75 45.63,161.75 45.72,161.66 45.72,161.11 47.06,159.77 47.62,159.77 47.92,159.46 53.47,159.46 v53.72,159.21
  Bottom 0.254: U$3.11 44.85,166.01 44.85,165.72 44.2,165.06 v44.2,161.75 | v53.72,159.21 HT16K33.P$5
N$19
  Bottom 0.254: U$4.16 58.17,165.48 57.94,165.25 55.83,165.25 55.66,165.09 55.66,162.72 52.45,159.51 52.45,157.42 52.48,157.39 52.48,156.35 52.73,156.1 52.73,155.05 52.83,155.15 52.83,154.31 HT16K33.P$6
N$20  (via drill 0.2)
  Top 0.254: v70.61,155.96 70.35,155.69 70.26,155.69 70.01,155.44 57.59,155.44 57.57,155.42 57.24,155.42 57.13,155.52 56.73,155.52 55.77,156.49 55.29,156.49 55.05,156.72 51.67,156.72 51.41,156.46 v51.18,156.46
  Bottom 0.254: HT16K33.P$7 v51.18,156.46 | v70.61,155.96 70.87,156.21 U$4.11
N$21  (via drill 0.2)
  Top 0.254: v96.27,155.19 95.89,154.81 90.04,154.81 90.03,154.82 86.92,154.82 85.13,156.61 84.14,156.61 83.84,156.31 83.29,156.31 82.99,156.61 70.34,156.61 69.58,155.85 57.42,155.85 57.4,155.83 57.3,155.93 56.9,155.93 55.71,157.13 50.91,157.13 50.74,156.95 49.64,156.95 49.62,156.97 v48.77,156.97
  Bottom 0.254: HT16K33.P$9 48.64,156.84 v48.77,156.97 | v96.27,155.19 U$5.11
N$22  (via drill 0.35)
  Top 0.254: v58.29,93.47 57.4,94.36 50.35,94.36 50.15,94.56 49.67,94.56 49.47,94.36 47.86,94.36 47.56,94.06 46.68,94.06 46.42,94.31 42.72,94.31 42.67,94.36 42.16,94.36 41.1,93.29 41.1,93.23 40.75,92.89 40.27,92.89 39.93,93.23 39.93,96.09 37.34,98.68 33.82,98.68 33.74,98.6 33.26,98.6 33.06,98.81 21.84,98.81 20.57,100.08 v7.37,100.08
  Bottom 0.254: HT16K4.P$2 57.53,92.71 v58.29,93.47 D5.A | v7.37,100.08 U$19.16
N$23  (via drill 0.2)
  Top 0.254: v19.05,78.74 20.96,76.83 34.1,76.83 34.18,76.76 34.24,76.76 36.07,74.93 36.07,71.5 36.32,71.25 41.66,71.25 43.31,72.9 49.21,72.9 49.67,73.35 50.15,73.35 50.4,73.1 53.02,73.1 53.14,72.98 54.3,72.98 54.42,73.1 55.56,73.1 55.77,72.9 57.66,72.9 v58.67,71.88
  Bottom 0.254: U$23.16 10.41,78.74 v19.05,78.74 | HT16K5.P$2 57.53,70.74 v58.67,71.88 59.05,72.26 D6.A
N$24  (via drill 0.2)
  Top 0.254: v57.53,49.4 57.28,49.4 56.64,50.04 56.07,50.04 55.87,50.24 55.38,50.24 55.18,50.04 51.62,50.04 51.42,49.84 50.94,49.84 50.74,50.04 48.64,50.04 48.35,50.33 47.72,50.33 47.2,50.85 45.45,50.85 44.64,50.04 33.4,50.04 26.77,56.67 21.56,56.67 21.03,57.2 17.79,57.2 17.46,57.53 v7.62,57.53
  Bottom 0.254: U$27.16 7.62,60.33 v7.62,57.53 | HT16K6.P$2 v57.53,49.4 59.18,51.05 D7.A
N$25  (via drill 0.2)
  Top 0.254: v57.66,30.23 56.9,30.23 56.26,30.86 52.2,30.86 52.1,30.76 50.33,30.76 50.15,30.94 49.48,30.94 49.3,30.76 48.48,30.76 48.38,30.86 42.29,30.86 v42.16,30.73 | v42.16,32 36.38,32 36.18,31.8 12.14,31.8 v7.49,36.45
  Bottom 0.254: HT16K7.P$2 57.53,28.96 58.42,29.84 | D8.A 58.42,29.84 | 58.42,29.84 58.04,29.84 v57.66,30.23 | v42.16,30.73 v42.16,32 | v7.49,36.45 7.37,36.58 U$31.16
N$26  (via drill 0.35)
  Top 0.254: v40.77,13.72 41.02,13.97 43.48,13.97 43.79,14.28 44.61,14.28 44.78,14.1 45.97,14.1 46.1,13.97 50.42,13.97 53.06,11.33 53.96,11.33 53.99,11.3 59.05,11.3 v59.05,11.18
  Bottom 0.254: U$37.16 9.78,15.75 19.36,15.75 20.94,14.17 30.17,14.17 30.42,13.92 31.3,13.92 31.63,14.25 32.2,14.25 33.09,13.36 33.91,13.36 34.67,14.12 36.12,14.12 36.12,14.58 36.29,14.74 40.5,14.74 40.77,14.48 v40.77,13.72 | v59.05,11.18 59.05,8.64 | HT16K8.P$2 57.53,7.11 59.05,8.64 | D9.A 59.05,8.64
N$32  (via drill 0.2)
  Top 0.254: U$2.2 7.49,154.05 17.08,154.05 17.74,154.71 20.85,154.71 21.59,155.45 v30.23,155.45 v42.29,155.45 44.2,155.45 45.34,156.59 48.22,156.59 48.5,156.31 50.4,156.31 50.91,155.81 51.45,155.81 51.96,156.31 54.89,156.31 55.63,155.57 | v81.03,155.45 81.03,155.57 71.63,155.57 71.34,155.29 70.43,155.29 70.17,155.04 57.76,155.04 57.74,155.02 57.07,155.02 57.02,155.07 55.63,155.07 55.63,155.57 | v55.63,155.7 55.63,155.57
  Bottom 0.254: v81.03,155.45 U$5.2 | U$4.2 v55.63,155.7 | U$3.2 v30.23,155.45 | HT16K33.P$14 v42.29,155.45
N$33  (via drill 0.2)
  Top 0.152: 60.83,150.75 61.11,150.47 61.4,150.47
  Top 0.254: U$2.4 11.15,151.38 12.07,150.47 35.43,150.47 | U$5.4 85.19,150.47 80.53,150.47 80.13,150.06 64.89,150.06 64.66,149.84 64.12,149.84 63.48,150.47 62.8,150.47 62.38,150.9 61.83,150.9 61.4,150.47 46.74,150.47 46.63,150.58 46.08,150.58 45.97,150.47 44.07,150.47 | 35.43,150.47 44.07,150.47 | U$3.4 35.43,151.26 35.43,150.47 | U$4.4 60.83,151.26 60.83,150.75 60.83,150.47 | v43.94,152.15 44.07,152.02 44.07,150.47
  Bottom 0.254: HT16K33.P$13 43.56,152.53 v43.94,152.15
N$34  (via drill 0.35)
  Top 0.254: 64.39,150.5 64.64,150.5 | 64.64,150.5 65.38,150.5 65.41,150.47 79.6,150.47 v79.88,150.75 | v62.1,150.24 61.85,149.99 46.42,149.99 v46.35,149.93 | 64.64,150.5 64.14,150.5 U$4.5
  Bottom 0.254: U$2.5 13.46,150.37 37.85,150.37 | U$5.5 87.63,150.37 80.26,150.37 v79.88,150.75 | 37.85,150.37 39.53,150.37 39.84,150.06 40.93,150.06 41.24,150.37 44.45,150.37 44.55,150.47 | U$4.5 63.25,150.37 63.37,150.37 63.25,150.24 v62.1,150.24 | U$3.5 37.85,150.37 | HT16K33.P$12 44.83,152.04 44.55,151.76 44.55,150.47 | v46.35,149.93 45.09,149.93 44.55,150.47
N$35  (via drill 0.2)
  Top 0.254: v20.07,154.05 22.44,154.05 22.46,154.03 38.52,154.03 38.77,154.27 41.04,154.27 41.09,154.22 45.97,154.22 45.97,154.56 | U$5.8 93.65,154 86.59,154 86.37,154.22 73.87,154.22 73.68,154.03 73.13,154.03 72.94,154.22 v70.87,154.22 58.1,154.22 58.08,154.2 57.02,154.2 46.1,154.2 46.1,154.43 45.97,154.56 | v45.97,155.45 45.97,154.56
  Bottom 0.254: U$2.8 v20.07,154.05 | U$4.8 v70.87,154.22 | U$3.8 45.47,154.05 | 45.47,154.05 45.47,154.81 45.97,155.32 v45.97,155.45 | HT16K33.P$11 45.97,154.05 45.47,154.05
N$54  (via drill 0.2)
  Top 0.254: U$14.7 93.73,131.95 93.32,132.36 53.21,132.36 44.6,132.36 | 68.33,132.1 v68.33,132.36 44.6,132.36 | v38.99,132.36 38.99,132.1 | v41.91,139.83 41.91,139.76 43.75,141.6 44.64,141.6 44.89,141.35 46.48,141.35 46.54,141.3 46.54,140.23 47.4,139.37 51.13,139.37 v51.18,139.32 | v17.53,132.36 17.63,132.36 18.02,132.74 19.24,132.74 19.79,132.18 20.34,132.18 20.57,132.41 27.17,132.41 27.47,132.1 39.33,132.1 39.63,132.41 v40.77,132.41 | 44.55,132.41 44.6,132.36 | v40.77,132.41 44.55,132.41 | 44.6,132.36 44.55,132.41 | 44.55,132.41 v40.77,132.41
  Bottom 0.254: U$11.7 v17.53,132.36 | U$13.7 v68.33,132.36 | v38.99,132.36 38.99,129.92 39.34,129.56 39.7,129.56 40.01,129.26 40.77,129.26 41.07,129.56 42.32,129.56 U$12.7 | U$12.7 42.93,133.94 42.95,133.97 42.95,138.79 v41.91,139.83 | v51.18,139.32 HT16K2.P$22 | U$12.7 40.77,132.33 v40.77,132.41
N$55  (via drill 0.2)
  Top 0.254: U$11.1 3.53,130.18 4.45,129.26 5.21,129.26 6.45,130.51 6.45,130.55 8.23,132.33 16.62,132.33 17.25,131.7 17.8,131.7 18.43,132.33 19.07,132.33 19.62,131.78 20.51,131.78 20.73,132.01 27,132.01 | 39.24,131.44 38.44,131.44 38.39,131.5 27.51,131.5 27,132.01 | 39.24,131.44 39.5,131.44 | 51.94,131.83 67.93,131.83 68.05,131.7 v77.6,131.7 78.11,131.7 | 51.94,131.83 51.94,131.32 v51.82,131.19 | 27,132.01 26.42,131.43 v26.42,131.19 | 51.94,131.83 44.56,131.83 44.38,132 41.29,132 41.04,131.75 40.49,131.75 40.24,132 39.8,132 39.24,131.44
  Bottom 0.254: U$14.1 77.6,131.06 v77.6,131.7 | U$13.1 52.83,130.18 v51.82,131.19 51.69,131.06 51.05,131.06 50.52,131.59 50.52,136.08 50.57,136.13 50.57,136.67 49.91,137.33 HT16K2.P$21 | v26.42,131.19 26.67,131.19 U$12.1
N$56  (via drill 0.2)
  Top 0.254: U$11.18 4.72,142.98 7.05,142.98 7.09,143.03 7.64,143.03 7.68,142.98 21.53,142.98 21.7,143.15 22.24,143.15 22.42,142.98 v27.69,142.98 28.89,142.98 28.94,143.03 29.48,143.03 29.53,142.98 32.79,142.98 32.89,143.07 34.11,143.07 34.2,142.98 42.03,142.98 42.28,143.23 45.31,143.23 45.56,142.98 53.21,142.98 | 53.09,142.98 v53.09,140.72 53.09,142.85 53.21,142.98 | v78.36,143 73.83,143 73.68,143.15 66.36,143.15 66.19,142.98 53.21,142.98
  Bottom 0.254: U$14.18 78.49,143.13 v78.36,143 | U$12.18 v27.69,142.98 | v53.09,140.72 U$13.18 49.28,145.41 48.92,145.06 48.92,145.04 48.64,144.76 HT16K2.P$20
N$57  (via drill 0.2)
  Top 0.254: v14.99,143.64 v40.39,143.64 46.86,143.64 | 46.86,143.64 v65.91,143.64 78.06,143.64 78.09,143.66 78.63,143.66 78.65,143.64 80.7,143.64 81.14,144.07 91.31,144.07 91.31,145.29 U$14.13 | v46.86,144.27 46.86,143.64
  Bottom 0.254: U$11.13 v14.99,143.64 | U$13.13 65.79,143.76 v65.91,143.64 | U$12.13 v40.39,143.64 | HT16K2.P$19 46.86,143.38 v46.86,144.27
N$58  (via drill 0.2)
  Top 0.254: U$11.6 14.99,131.7 16.68,131.7 17.09,131.29 17.97,131.29 18.37,131.7 19.13,131.7 19.46,131.37 20.68,131.37 20.9,131.6 25.76,131.6 25.76,130.92 26.14,130.53 26.69,130.53 27.24,131.09 38.22,131.09 38.28,131.04 39.66,131.04 | U$14.6 91.19,131.57 91.06,131.7 78.68,131.7 78.27,131.29 78.12,131.29 77.87,131.04 77.33,131.04 77.07,131.29 67.89,131.29 67.76,131.42 | U$12.6 39.66,130.9 39.66,131.04 | U$13.6 65.79,131.29 | 65.91,131.42 65.79,131.29 | v46.74,130.88 46.74,131.29 46.86,131.42 | 46.86,131.42 51.16,131.42 51.16,130.92 51.54,130.53 52.09,130.53 52.47,130.92 52.47,131.42 67.76,131.42 | 39.66,131.04 39.97,131.34 41.21,131.34 41.46,131.59 44.21,131.59 44.39,131.42 46.86,131.42 | 65.79,131.29 67.63,131.29 67.76,131.42
  Bottom 0.254: HT16K2.P$18 46.1,141.73 46.76,141.07 46.76,133.84 46.74,133.82 v46.74,130.88
N$59  (via drill 0.2)
  Top 0.254: v40.51,135.89 41.78,137.16 51.14,137.16 51.42,136.88 54.78,136.88 55.06,137.16 57.4,137.16 57.45,137.11 62.95,137.11 63,137.16 63.37,137.16 v64.64,135.89
  Bottom 0.254: R8.1 R10.1 R9.1 v40.51,135.89 | v64.64,135.89 D3.C
N$61  (via drill 0.2)
  Top 0.254: U$11.17 4.83,146.15 v5.33,146.66 | v75.38,146.26 73.86,146.26 73.79,146.33 62.87,146.33 62.79,146.26 v61.98,146.26 | v59.56,146.26 58.62,146.26 58.54,146.33 56.54,146.33 U$13.17 54.38,145.41 53.46,144.5 52.71,144.5 51.79,145.41 51.56,145.41 v50.8,146.18
  Bottom 0.254: v5.33,146.66 5.84,146.66 6.29,147.11 6.86,147.11 30.35,147.08 | U$14.17 81.03,146 80.01,147.02 76.14,147.02 v75.38,146.26 | 30.35,147.08 30.23,146.95 U$12.17 | v61.98,146.26 61.16,146.26 61.09,146.33 60.33,146.33 60.25,146.26 v59.56,146.26 | v50.8,146.18 48.54,146.18 48.38,146.33 46.48,146.33 | 30.35,147.08 31.1,146.33 46.48,146.33 | HT16K2.P$17 45.5,143.55 45.5,143.88 46.48,144.86 46.48,146.33
N$62  (via drill 0.2)
  Top 0.254: U$11.15 9.91,146.3 10.41,146.81 26.64,146.81 v27.03,146.43 | v29.34,146.42 29.83,146.91 35.31,146.91 | v52.32,146.39 51.8,146.91 44.2,146.91 | v53.85,146.39 54.37,146.91 60.58,146.91 | v76.58,145.98 75.65,146.91 73.53,146.91 60.58,146.91 | v79.76,145.98 80.72,146.94 84.58,146.94 U$14.15 | 35.31,146.91 44.2,146.91 | U$13.15 60.58,145.54 60.58,146.91 | U$12.15 35.31,146.91 | v44.2,144.78 44.2,146.91
  Bottom 0.254: v27.03,146.43 27.28,146.67 29.09,146.67 v29.34,146.42 | v52.32,146.39 v53.84,146.39 v53.85,146.39 | v76.58,145.98 77.03,146.43 79.3,146.43 v79.76,145.98 | HT16K2.P$16 43.56,144.15 v44.2,144.78
N$63  (via drill 0.2)
  Top 0.254: U$11.14 12.45,144.27 14.69,144.27 14.71,144.29 v41.66,144.29 | U$13.14 63.37,145.29 63.37,144.29 | 63.37,144.29 63.37,144.27 | U$12.14 37.97,145.29 37.97,144.78 | 37.97,144.78 37.97,144.27 | 63.37,144.29 53.83,144.29 53.63,144.09 52.54,144.09 52.34,144.29 47.77,144.29 47.13,144.93 46.59,144.93 45.96,144.29 44.64,144.29 44.47,144.12 43.92,144.12 43.75,144.29 v41.66,144.29 | U$14.14 88.65,144.47 80.97,144.47 80.77,144.27 66.21,144.27 66.19,144.29 63.37,144.29 | 37.97,144.78 38.46,144.29 v41.66,144.29
  Bottom 0.254: HT16K2.P$15 41.66,143.51 v41.66,144.29
N$64  (via drill 0.2)
  Top 0.254: U$11.2 7.49,132.84 17.08,132.84 17.74,133.5 20.85,133.5 21.59,134.24 v30.23,134.24 v42.29,134.24 44.2,134.24 45.47,135.51 48.09,135.51 48.5,135.1 50.4,135.1 50.91,134.6 51.45,134.6 51.96,135.1 54.89,135.1 55.63,134.37 | v81.03,134.24 81.03,134.37 71.63,134.37 71.34,134.08 70.43,134.08 70.17,133.83 69.74,133.83 69.67,133.76 68.51,133.76 68.44,133.83 57.76,133.83 57.74,133.81 57.07,133.81 57.02,133.86 55.63,133.86 55.63,134.37 | v55.63,134.49 55.63,134.37
  Bottom 0.254: v81.03,134.24 U$14.2 | U$13.2 v55.63,134.49 | U$12.2 v30.23,134.24 | HT16K2.P$14 v42.29,134.24
N$65  (via drill 0.2)
  Top 0.152: 60.83,129.26 61.4,129.26
  Top 0.254: U$11.4 11.15,130.18 12.07,129.26 35.43,129.26 | U$14.4 85.19,129.26 80.53,129.26 80.13,128.85 64.89,128.85 64.66,128.63 64.12,128.63 63.48,129.26 62.8,129.26 62.38,129.69 61.83,129.69 61.4,129.26 | 35.43,129.26 44.07,129.26 | U$12.4 35.43,130.05 35.43,129.26 | U$13.4 60.83,130.05 60.83,129.26 46.74,129.26 46.63,129.38 46.08,129.38 45.97,129.26 44.07,129.26 | v43.94,130.94 44.07,130.81 44.07,129.26
  Bottom 0.254: HT16K2.P$13 43.56,131.32 v43.94,130.94
N$66  (via drill 0.35)
  Top 0.254: 64.39,129.29 64.64,129.29 | 64.64,129.29 65.38,129.29 65.41,129.26 79.6,129.26 v79.88,129.54 | v62.1,129.03 61.85,128.78 46.42,128.78 v46.35,128.72 | 64.64,129.29 64.14,129.29 U$13.5
  Bottom 0.254: U$11.5 13.46,129.16 37.85,129.16 | U$14.5 87.63,129.16 80.26,129.16 v79.88,129.54 | 37.85,129.16 39.53,129.16 39.84,128.85 40.93,128.85 41.24,129.16 44.45,129.16 44.55,129.26 | U$13.5 63.25,129.16 63.37,129.16 63.25,129.03 v62.1,129.03 | U$12.5 37.85,129.16 | HT16K2.P$12 44.83,130.83 44.55,130.55 44.55,129.26 | v46.35,128.72 45.09,128.72 44.55,129.26
N$67  (via drill 0.2)
  Top 0.254: v20.07,132.84 22.44,132.84 22.46,132.82 38.52,132.82 38.77,133.06 41.04,133.06 41.09,133.01 45.97,133.01 45.97,133.35 | U$14.8 93.65,132.79 86.59,132.79 86.37,133.01 73.87,133.01 73.68,132.82 73.13,132.82 72.94,133.01 v70.87,133.01 70.07,133.01 70,132.94 68.17,132.94 68.1,133.01 58.1,133.01 58.08,132.99 46.1,132.99 46.1,133.22 45.97,133.35 | v45.97,134.24 45.97,133.35
  Bottom 0.254: U$11.8 v20.07,132.84 | U$13.8 v70.87,133.01 | U$12.8 45.47,132.84 | 45.47,132.84 45.47,133.6 45.97,134.11 v45.97,134.24 | HT16K2.P$11 45.97,132.84 45.47,132.84
N$71  (via drill 0.2)
  Top 0.254: v44.2,140.54 45.63,140.54 45.72,140.45 45.72,139.9 47.06,138.56 47.62,138.56 47.92,138.25 53.47,138.25 v53.72,138
  Bottom 0.254: U$12.11 44.85,144.8 44.85,144.51 44.2,143.85 v44.2,140.54 | v53.72,138 53.72,137.75 53.59,137.62 53.59,132.84 HT16K2.P$5
N$72  (via drill 0.2)
  Top 0.254: v54.86,139.32 53.77,139.32 53.7,139.25 52.48,139.25 52.28,139.45 51.98,139.45 51.45,139.98 50.91,139.98 50.71,139.78 47.56,139.78 46.94,140.4 46.94,141.47 46.65,141.76 45.06,141.76 44.8,142.01 43.59,142.01 43.58,142.01 42.78,142.01 42.38,141.6 v33.5,141.6
  Bottom 0.254: v33.5,141.6 33.25,141.86 33.25,141.89 32.77,142.37 U$12.16 | HT16K2.P$4 54.99,134.2 54.97,134.22 54.97,139.22 v54.86,139.32
N$73  (via drill 0.35)
  Top 0.254: v52.7,137.54 53.36,137.54 53.48,137.42 54.74,137.42 55.83,138.5 56.5,138.5 56.73,138.28 v57.78,138.28
  Bottom 0.254: U$13.16 58.17,144.27 57.94,144.04 56.9,144.04 56.9,139.17 v57.78,138.28 | HT16K2.P$6 52.83,133.1 52.83,133.94 52.73,133.84 52.73,134.89 52.48,135.14 52.48,135.51 52.48,136.19 | 52.48,136.19 52.45,136.21 | 52.48,136.19 52.48,137.31 v52.7,137.54
N$74  (via drill 0.2)
  Top 0.254: v70.61,134.75 70.35,134.49 70.26,134.49 70.01,134.23 69.57,134.23 69.5,134.16 68.68,134.16 68.61,134.23 57.59,134.23 57.57,134.21 57.24,134.21 57.13,134.31 56.73,134.31 55.77,135.28 55.29,135.28 55.05,135.51 51.67,135.51 51.41,135.25 v51.18,135.25
  Bottom 0.254: HT16K2.P$7 v51.18,135.25 | v70.61,134.75 70.87,135 U$13.11
N$75  (via drill 0.2)
  Top 0.254: v49.91,136.4 55.8,136.4 57.05,135.15 v69.09,135.15 | v82.42,142.11 81.41,141.1 69.91,141.1 69.84,141.02 69.13,141.02 v68.84,141.32
  Bottom 0.254: HT16K2.P$8 v49.91,136.4 | U$14.16 83.57,143.26 v82.42,142.11 | v68.84,141.32 68.84,135.4 v69.09,135.15
N$76  (via drill 0.2)
  Top 0.254: v48.77,135.76 49.62,135.76 49.64,135.74 50.74,135.74 50.91,135.92 55.71,135.92 56.9,134.72 57.3,134.72 57.4,134.62 57.42,134.64 68.78,134.64 68.85,134.57 69.33,134.57 69.4,134.64 69.58,134.64 70.34,135.41 v70.27,135.48 | v69.6,141.6 72.9,141.6 73,141.5 80.55,141.5 81.74,142.7 82.66,142.7 82.74,142.62 v91.31,142.62
  Bottom 0.254: HT16K2.P$9 48.64,135.64 v48.77,135.76 | v91.31,142.62 92.04,142.62 92.31,142.35 93.2,142.35 U$14.11 | v69.6,141.6 69.6,136.15 v70.27,135.48
N$77  (via drill 0.2)
  Top 0.254: v55.63,141.22 55.36,141.49 53.53,139.65 52.64,139.65 52.11,140.19 51.82,140.19 51.62,140.38 50.74,140.38 50.54,140.19 47.73,140.19 47.35,140.57 47.35,141.63 46.82,142.17 45.22,142.17 44.97,142.42 42.61,142.42 42.21,142.01 34.02,142.01 33.77,142.26 33.23,142.26 32.67,141.71 28.03,141.71 27.42,142.32 27.41,142.32 27.16,142.57 22.26,142.57 22.18,142.49 v21.97,142.49
  Bottom 0.254: U$11.11 21.97,143.51 v21.97,142.49 | v55.63,141.22 55.63,138.22 55.6,138.19 55.6,135.45 56.28,134.76 56.28,132.74 HT16K2.P$3
N$80  (via drill 0.2)
  Top 0.254: U$18.7 93.73,110.74 93.32,111.15 53.21,111.15 44.6,111.15 | 68.33,110.9 v68.33,111.15 44.6,111.15 | v38.99,111.15 38.99,110.9 | v41.91,118.62 41.91,118.55 43.75,120.4 44.64,120.4 44.89,120.14 46.48,120.14 46.54,120.09 46.54,119.03 47.4,118.16 51.13,118.16 v51.18,118.11 | v17.53,111.15 17.63,111.15 18.02,111.53 19.24,111.53 19.79,110.97 20.34,110.97 20.57,111.2 27.17,111.2 27.47,110.9 39.33,110.9 39.63,111.2 v40.77,111.2 | 44.55,111.2 44.6,111.15 | v40.77,111.2 44.55,111.2 | 44.6,111.15 44.55,111.2 | 44.55,111.2 v40.77,111.2
  Bottom 0.254: U$15.7 v17.53,111.15 | U$17.7 v68.33,111.15 | v38.99,111.15 38.99,108.71 39.34,108.36 39.7,108.36 40.01,108.05 40.77,108.05 41.07,108.36 42.32,108.36 U$16.7 | U$16.7 42.93,112.73 42.95,112.76 42.95,117.58 v41.91,118.62 | v51.18,118.11 HT16K3.P$22 | U$16.7 40.77,111.12 v40.77,111.2
N$81  (via drill 0.2)